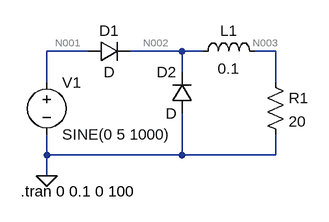
[diagram p0: schematic test.asc]
test.asc, the LTspice schematic file:
Version 4
SHEET 1 880 680
WIRE 128 48 64 48
WIRE 272 48 192 48
WIRE 304 48 272 48
WIRE 416 48 384 48
WIRE 272 80 272 48
WIRE 64 96 64 48
WIRE 416 96 416 48
WIRE 64 208 64 176
WIRE 272 208 272 144
WIRE 272 208 64 208
WIRE 416 208 416 176
WIRE 416 208 272 208
WIRE 64 240 64 208
FLAG 64 240 0
SYMBOL voltage 64 80 R0
WINDOW 123 0 0 Left 0
WINDOW 39 0 0 Left 0
SYMATTR InstName V1
SYMATTR Value SINE(0 5 1000)
SYMBOL diode 128 64 R270
WINDOW 0 32 32 VTop 2
WINDOW 3 0 32 VBottom 2
SYMATTR InstName D1
SYMBOL ind 288 64 R270
WINDOW 0 32 56 VTop 2
WINDOW 3 5 56 VBottom 2
SYMATTR InstName L1
SYMATTR Value 0.1
SYMBOL res 400 80 R0
SYMATTR InstName R1
SYMATTR Value 20
SYMBOL diode 288 144 R180
WINDOW 0 24 64 Left 2
WINDOW 3 24 0 Left 2
SYMATTR InstName D2
TEXT 24 264 Left 2 !.tran 0 0.1 0 100

The netlist it stands for:
* test.asc
V1 N001 0 SINE(0 5 1000)
D1 N001 N002 D
L1 N002 N003 0.1
R1 N003 0 20
D2 0 N002 D
.model D D
.lib standard.dio
.tran 0 0.1 0 100
.backanno
.end

* Results of the author's LTspice run, read from the files saved beside the schematic
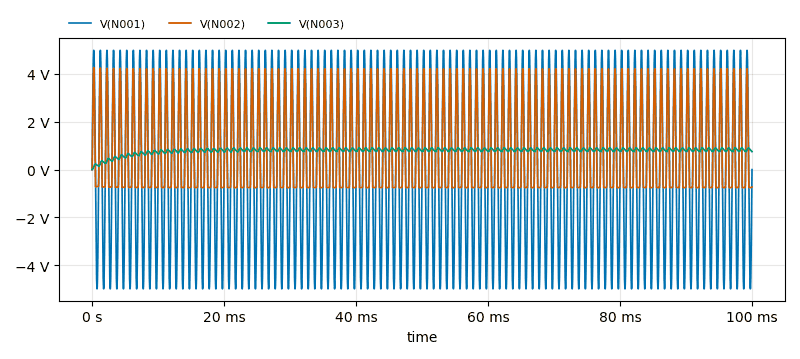
[diagram p1: Transient Analysis of test.asc, plotted from the saved traces]
* Transient Analysis, 1 run:
*   V(N001): min -4.989 V, max 4.989 V, average -9.006 µV, rms 3.549 V, last 0 V
*   V(N002): min -753.6 mV, max 4.269 V, average 809 mV, rms 2.082 V, last -731.1 mV
*   V(N003): min 0 V, max 913.7 mV, average 792.5 mV, rms 802 mV, last 749.3 mV